# EAGLE design dl3 (EAGLE 9.5.1)
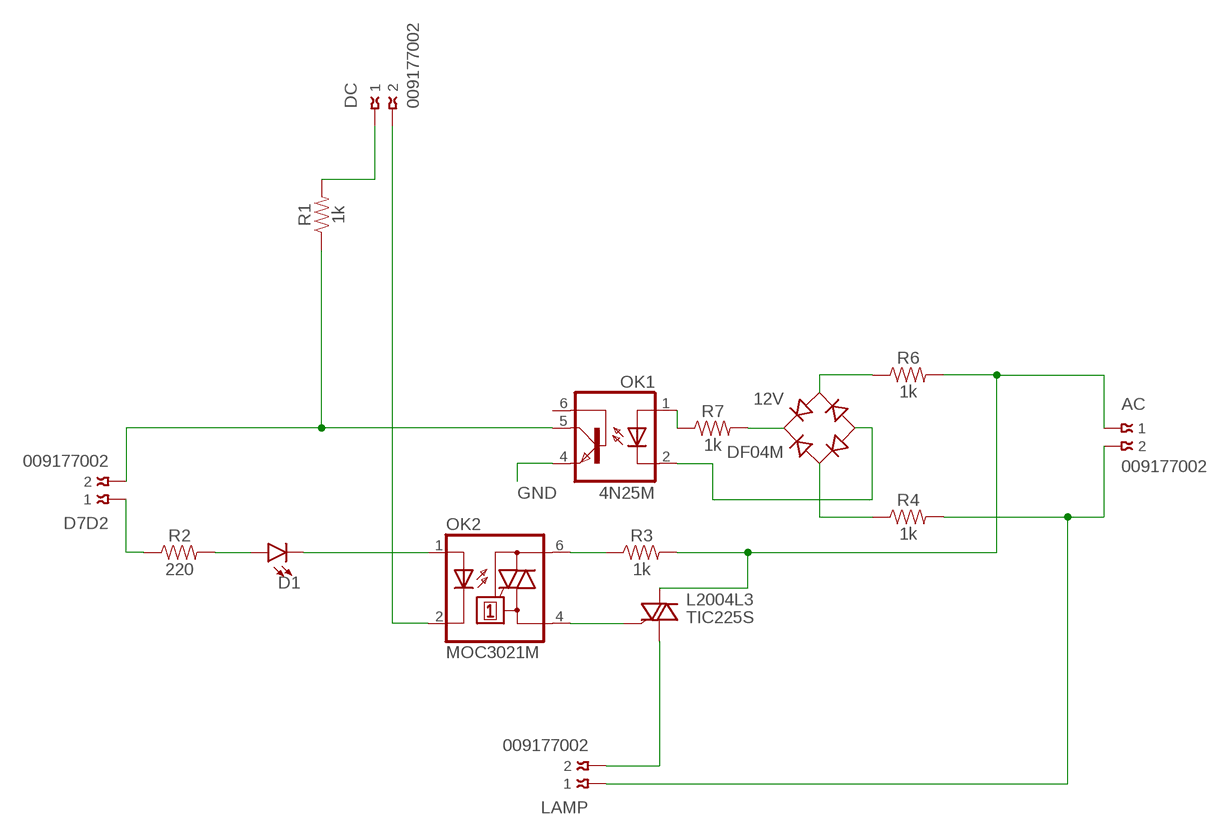
[diagram p0: schematic, sheet 1]

## Parts
AC  009177002  [009177002]
D1  LED1206  [LED-1206]
D7D2  009177002  [009177002]
DC  009177002  [009177002]
DF04M  12V  B-DIL  [B-DIL]
L2004L3  TIC225S  [TO220DS]
LAMP  009177002  [009177002]
OK1  4N25M  [DIL06]
OK2  MOC3021M  [DIL06]
R1  1k  1KOHM-HORIZ-1/4W-1%  [AXIAL-0.3]
R2  220  0.75OHM-0805-1/4W-1%  [0805]
R3  1k  1KOHM-HORIZ-1/4W-1%  [AXIAL-0.3]
R4  1k  1KOHM-HORIZ-1/4W-1%  [AXIAL-0.3]
R6  1k  1KOHM-HORIZ-1/4W-1%  [AXIAL-0.3]
R7  1k  0.75OHM-0805-1/4W-1%  [0805]

## Nets
GND: AC.2 LAMP.1 OK1.4(EMI) R4.P$2
IO2: D7D2.2 OK1.5(COL) R1.P$1
N$1: DF04M.+ R7.2
N$2: D1.A R2.2
N$3: D1.C OK2.1(A)
N$4: D7D2.1 R2.1
N$5: DC.1 R1.P$2
N$6: OK2.6(A2) R3.P$1
N$7: L2004L3.G OK2.4(A1)
N$8: OK1.1(A) R7.1
N$9: DF04M.- OK1.2(C)
N$10: DF04M.AC1 R4.P$1
N$11: DC.2 OK2.2(C)
N$12: AC.1 L2004L3.A2 R3.P$2 R6.P$2
N$13: DF04M.AC2 R6.P$1
N$15: L2004L3.A1 LAMP.2
Unconnected: OK1.6(BAS)

## Library data of the parts
AC D7D2 DC LAMP = con-avx:00917?002: Wire to Board Strip IDC Connector 2 WAY Source: http://www.avx.com/docs/Catalogs/9176.pdf http://www.avx.com/docs/Catalogs/9177.pdf; MPN: 009177002001006; OC_FARNELL: unknown; OC_NEWARK: 09P1124
D1 = SparkFun-LED:LED: LED (Generic) Standard schematic elements and footprints for 5mm, 3mm, 1206, and 0603 sized LEDs. Generic LEDs with no color specified.
DF04M = rectifier:B-DIL: RECTIFIER
L2004L3 = triac:TIC225S: TRIAC
OK1 = optocoupler:4N*?M: General Purpose 6-Pin Phototransistor Optocouplers Source: http://www.fairchildsemi.com/ds/4N/4N35-M.pdf; MPN: 4N25-M; OC_FARNELL: 1021349; OC_NEWARK: 98K9084
OK2 = optocoupler:MOC30*M: RANDOM-PHASE OPTOISOLATORS TRIAC DRIVER OUTPUT Source: http://www.fairchildsemi.com MOC3020-M.pdf; MF: FAIRCHILD SEMICONDUCTOR; MPN: MOC3021-M; OC_FARNELL: 1021365; OC_NEWARK: 95B7895
R1 R3 R4 R6 = SparkFun-Resistors:1KOHM: 1kΩ resistor A resistor is a passive two-terminal electrical component that implements electrical resistance as a circuit element. Resistors act to reduce current flow, and, at the same time, act to lower voltage levels within circuits. - Wikipedia; PROD_ID: RES-12182
R2 R7 = SparkFun-Resistors:0.75OHM: 0.75Ω resistor A resistor is a passive two-terminal electrical component that implements electrical resistance as a circuit element. Resistors act to reduce current flow, and, at the same time, act to lower voltage levels within circuits. - Wikipedia; PROD_ID: RES-08474; VALUE: 0.75

## Board
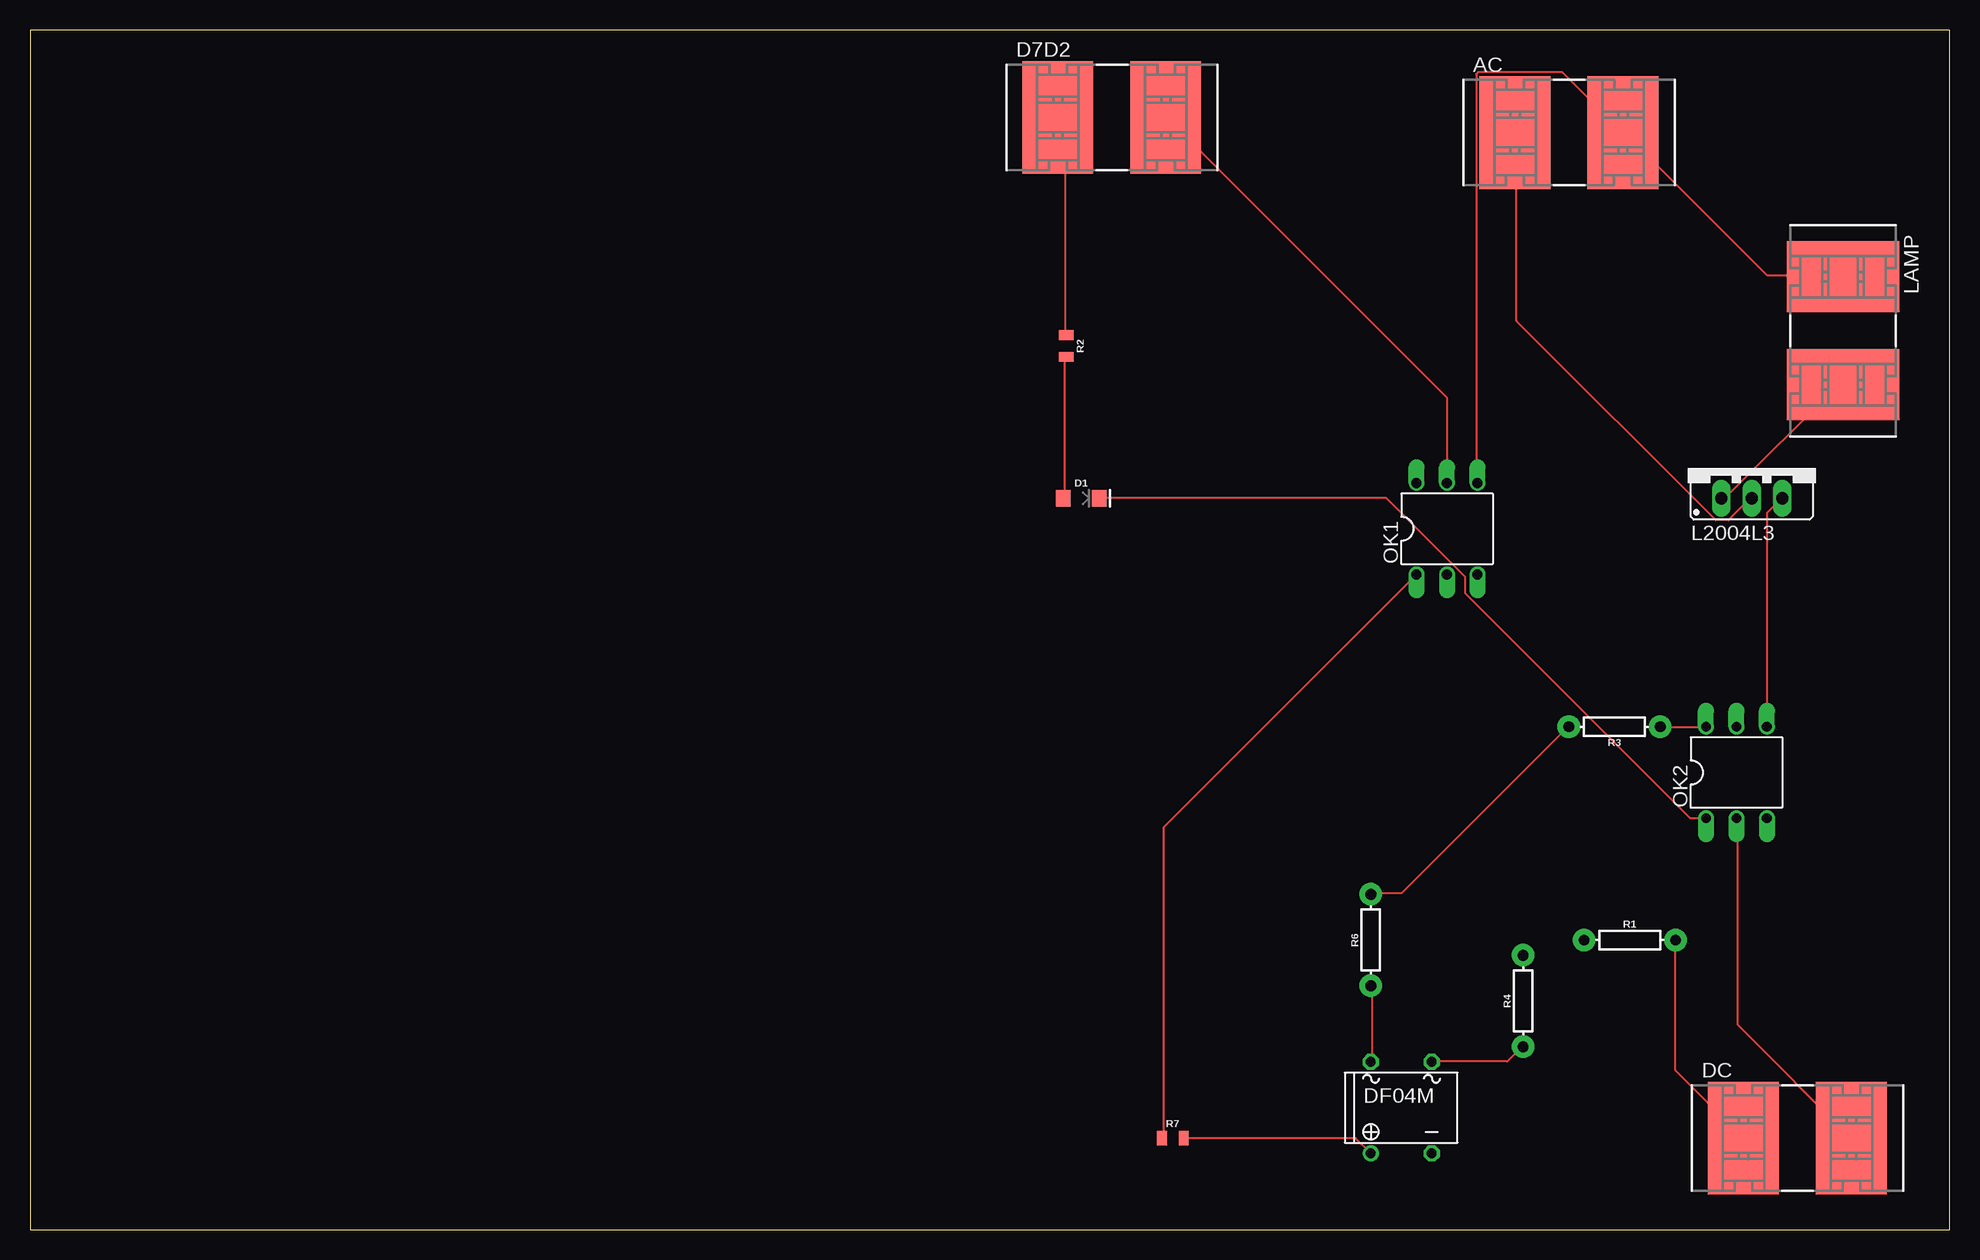
[diagram p1: board, top side]
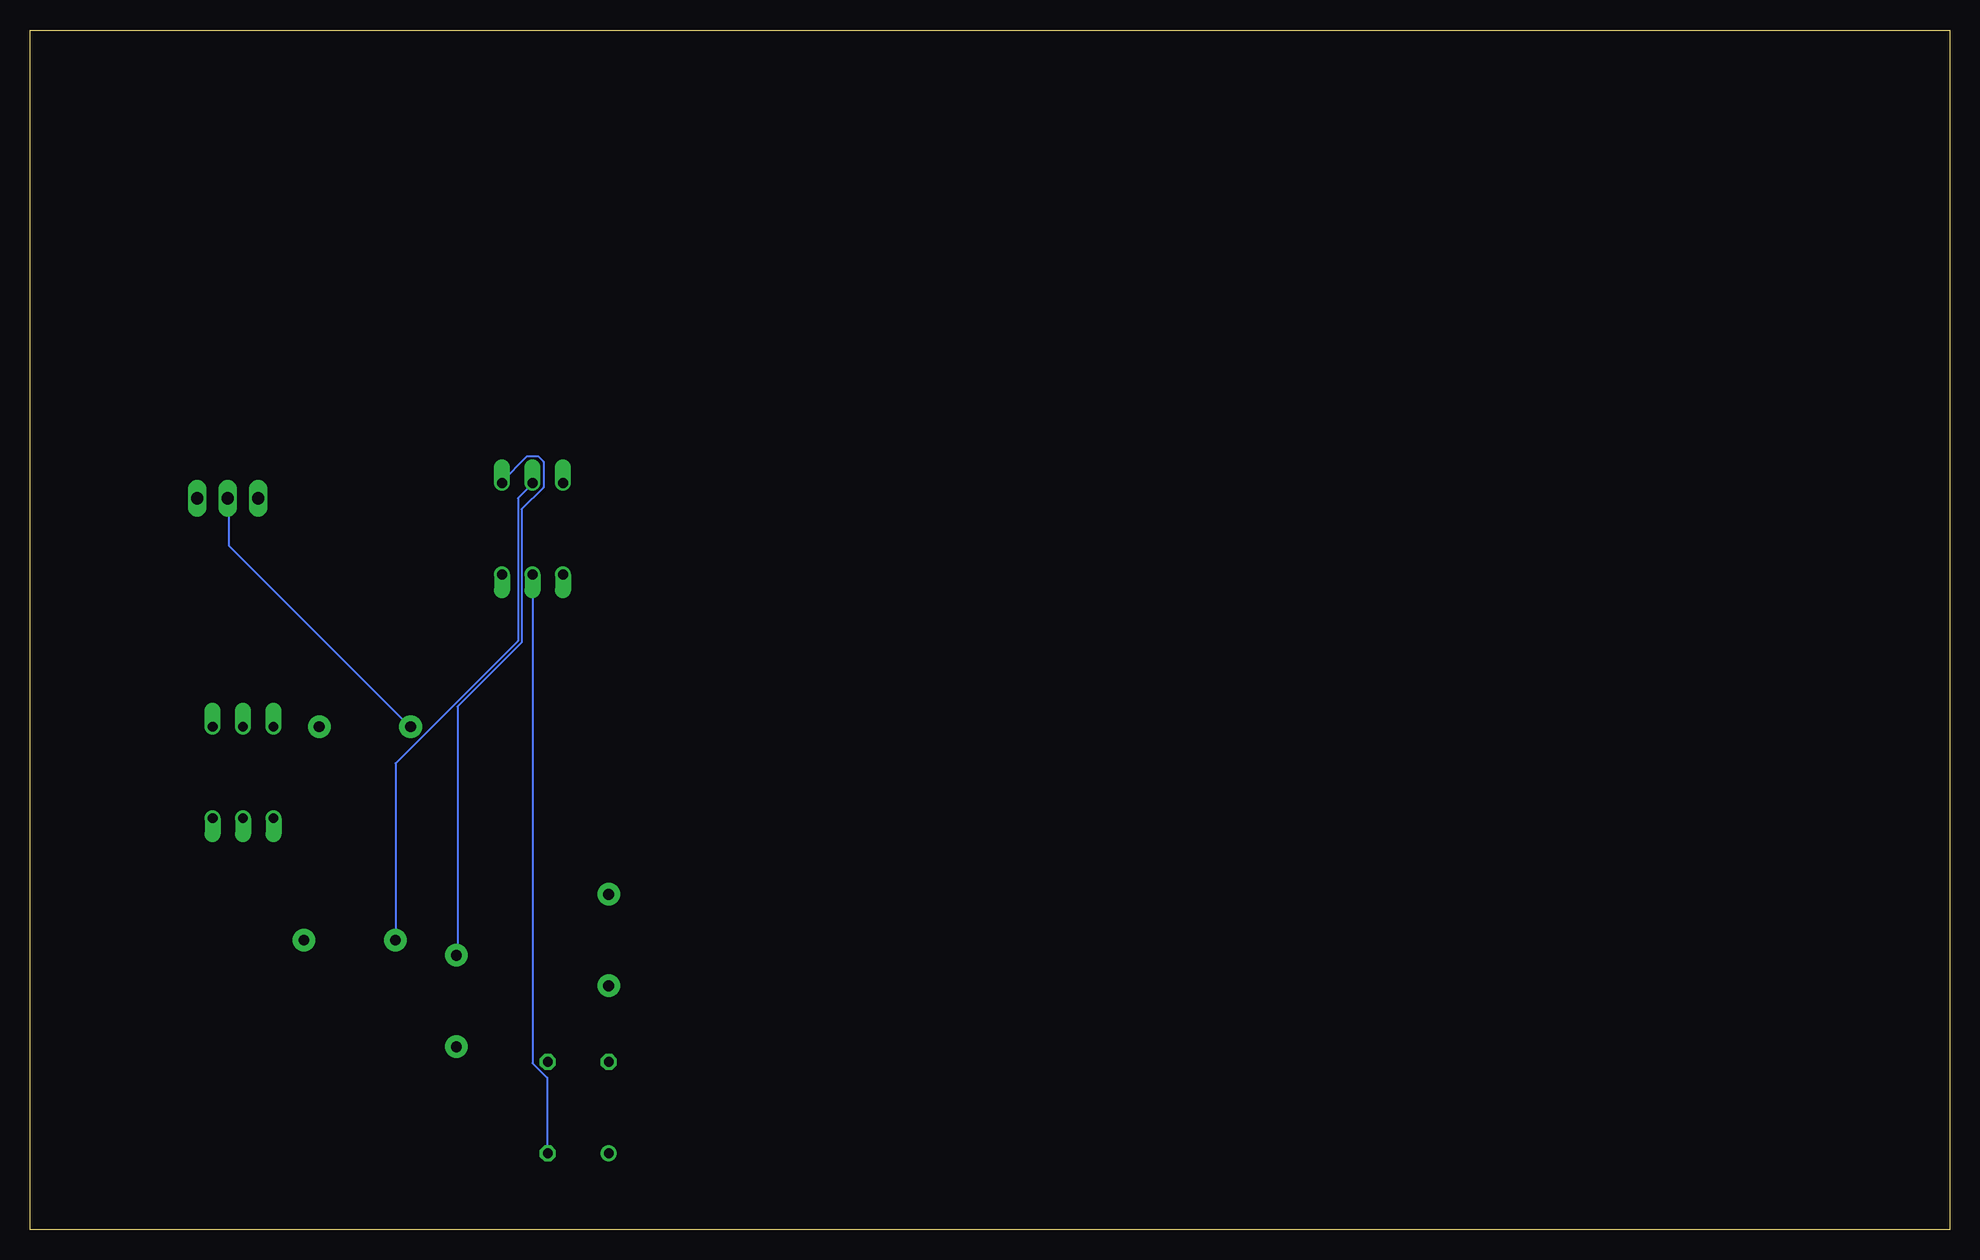
[diagram p2: board, bottom side, seen from below]

Size 160 x 100 mm. Coordinates in mm from the lower left corner, seen from the top.
Outline: 0,0 160,0 160,100 0,100 0,0
Copper layers (1*16): Top 0.035mm / dielectric 1.5mm / Bottom 0.035mm
Design rules "default": minimum track width 6mil, minimum drill 0.35mm, track to track 6mil, track to pad 6mil, pad to pad 6mil, via to via 6mil, smd to smd 6mil, copper to edge 40mil, drill to drill 6mil, minimum pad ring 10mil, minimum via ring 8mil, stop-mask expansion 4mil, vias tented up to drill 0mil, thermal gap 10mil

### Footprints (pad centres in the part's own frame; a part is rotated, then mirrored left to right if it is on the bottom)
009177002 = smd 5.9 x 9.4: 1 -4.5,0; 2 4.5,0
LED-1206 = smd 1.2 x 1.4: A -1.5,0; C 1.5,0
B-DIL = drill 0.813: + -2.54,-3.81 | drill 0.813 octagon: - 2.54,-3.81; AC1 2.54,3.81; AC2 -2.54,3.81
TO220DS = drill 1.016 long: A1 -2.54,-2.54; A2 0,-2.54; G 2.54,-2.54
DIL06 = drill 0.813 offset: 1 -2.54,-3.81; 2 0,-3.81; 3 2.54,-3.81; 4 2.54,3.81; 5 0,3.81; 6 -2.54,3.81
AXIAL-0.3 = drill 0.9 pad 1.88: P$1 -3.81,0; P$2 3.81,0
0805 = smd 0.8 x 1.2: 1 -0.9,0; 2 0.9,0

### Placement (x,y rotation side)
AC  128.27,91.44 0 top
D1  87.63,60.96 0 top
D7D2  90.17,92.71 0 top
DC  147.32,7.62 0 top
DF04M  114.3,10.16 0 top
L2004L3  143.51,63.5 0 top
LAMP  151.13,74.93 270 top
OK1  118.11,58.42 0 top
OK2  142.24,38.1 0 top
R1  133.35,24.13 0 top
R2  86.36,73.66 270 top
R3  132.08,41.91 180 top
R4  124.46,19.05 90 top
R6  111.76,24.13 90 top
R7  95.25,7.62 0 top

### Tracks (layer width: path | path; a pad name or v marks a point on that pad's centre or on a via)
GND
  Top 0.152: OK1.4 120.55,62.33 120.55,96.32 120.7,96.47 127.71,96.47 132.74,91.44 AC.2 132.89,91.44 144.78,79.55 151.03,79.55 LAMP.1
  Bottom 0.152: R4.P$2 124.36,22.86 124.36,43.59 119.02,48.92 119.02,60.05 117.2,61.87 117.2,64.01 117.65,64.47 118.57,64.47 120.7,62.33 OK1.4
IO2
  Top 0.152: OK1.5 118.11,69.34 94.79,92.66 D7D2.2
  Bottom 0.152: R1.P$1 129.54,38.86 119.33,49.07 119.33,60.96 118.11,62.18 OK1.5
N$1
  Top 0.152: R7.2 110.49,7.62 DF04M.+
N$2
  Top 0.152: R2.2 86.26,72.69 86.26,60.96 D1.A
N$3
  Top 0.152: D1.C 113.08,60.96 119.63,54.41 119.63,53.03 138.38,34.29 OK2.1
N$4
  Top 0.152: R2.1 86.26,74.68 86.26,92.2 85.8,92.66 D7D2.1
N$5
  Top 0.152: R1.P$2 137.16,13.26 142.8,7.62 DC.1
N$6
  Top 0.152: R3.P$1 OK2.6
N$7
  Top 0.152: OK2.4 144.78,59.74 146,60.96 L2004L3.G
N$8
  Top 0.152: OK1.1 94.49,33.53 94.49,7.62 R7.1
N$9
  Bottom 0.152: OK1.2 118.11,13.87 116.89,12.65 116.89,6.4 DF04M.-
N$10
  Top 0.152: DF04M.AC1 116.89,14.02 123.14,14.02 124.36,15.24 R4.P$1
N$11
  Top 0.152: OK2.2 142.34,34.29 142.34,17.07 151.79,7.62 DC.2
N$12
  Top 0.152: R6.P$2 111.86,28.04 114.3,28.04 128.17,41.91 R3.P$2 | AC.1 123.9,91.44 123.9,75.74 140.51,59.13 141.58,59.13 143.41,60.96 L2004L3.A2
  Bottom 0.152: L2004L3.A2 143.41,60.96 143.41,57 128.32,41.91 R3.P$2
N$13
  Top 0.152: DF04M.AC2 111.86,14.02 111.86,20.27 R6.P$1
N$15
  Top 0.152: L2004L3.A1 141.28,60.96 150.72,70.41 151.03,70.41 LAMP.2